# EAGLE design ow_lcd_mirror3 (EAGLE 6.5.0)
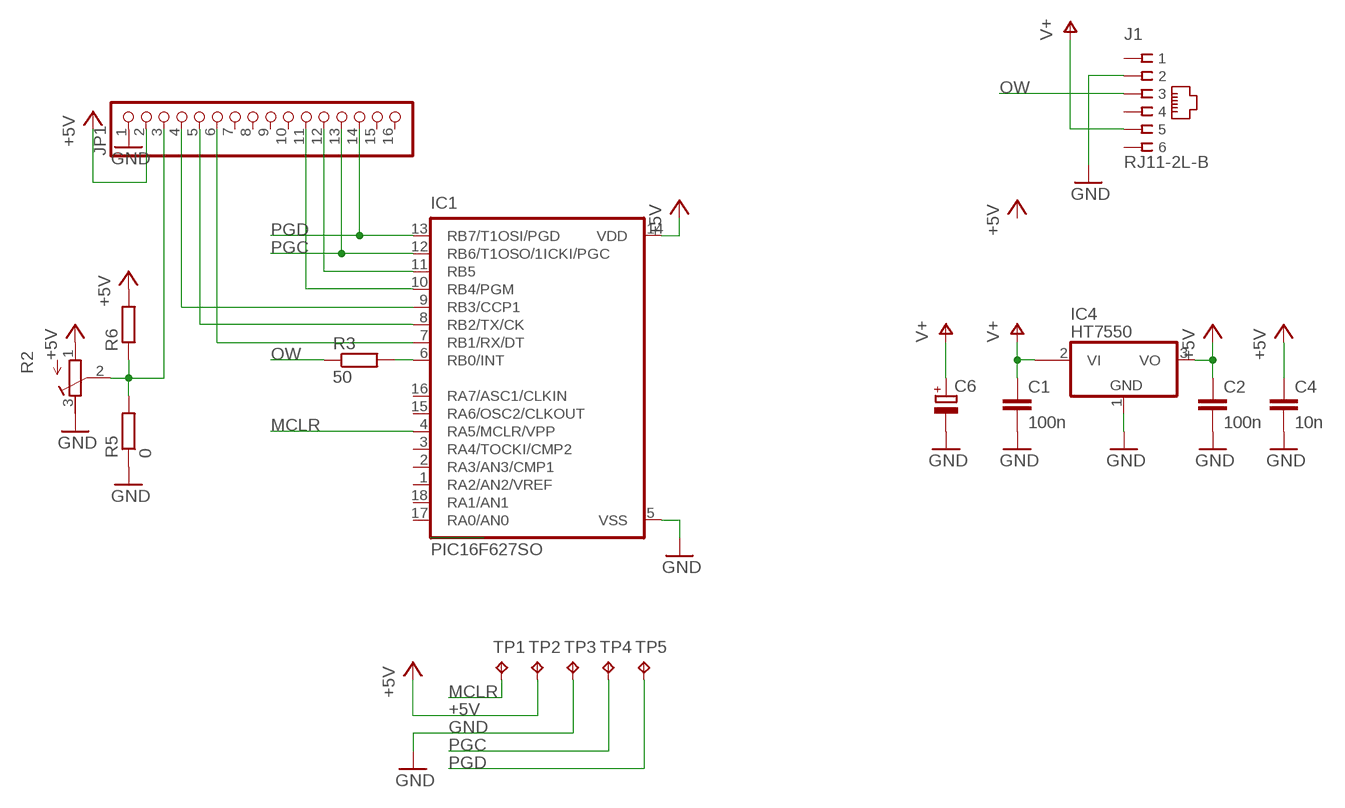
[diagram p0: schematic, sheet 1]

## Parts
C1  100n  C-EUC1206  [C1206]
C2  100n  C-EUC1206  [C1206]
C4  10n  C-EUC1206  [C1206]
C6  CPOL-EUC/6032-28R  [C/6032-28R]
IC1  PIC16F627SO  [SO-18W]
IC4  HT7550  MCP170312MB  [SOT89]
J1  RJ11-2L-B  [RJ11-NO_SHIELD]
JP1  PINHD-1X16  [1X16]
R2  R-TRIMM3339P  [RTRIM3339P]
R3  50  R-EU_M1206  [M1206]
R5  0  R-EU_R0805  [R0805]
R6  R-EU_R0805  [R0805]
TP1  TPB1,27  [B1,27]
TP2  TPB1,27  [B1,27]
TP3  TPB1,27  [B1,27]
TP4  TPB1,27  [B1,27]
TP5  TPB1,27  [B1,27]

## Nets
+5V: C2.1 C4.1 IC1.14(VDD) IC4.3(VO) JP1.2 R2.1(E) R6.2 TP2.TP
GND: C1.2 C2.2 C4.2 C6.- IC1.5(VSS) IC4.1(GND) J1.2 JP1.1 R2.3(A) R5.1 TP3.TP
MCLR: IC1.4(RA5/MCLR/VPP) TP1.TP
N$2: IC1.8(RB2/TX/CK) JP1.5
N$3: IC1.11(RB5) JP1.12
N$4: IC1.10(RB4/PGM) JP1.11
N$5: IC1.9(RB3/CCP1) JP1.4
N$6: IC1.7(RB1/RX/DT) JP1.6
N$8: JP1.3 R2.2(S) R5.2 R6.1
N$9: IC1.6(RB0/INT) R3.2
OW: J1.3 R3.1
PGC: IC1.12(RB6/T1OSO/1ICKI/PGC) JP1.13 TP4.TP
PGD: IC1.13(RB7/T1OSI/PGD) JP1.14 TP5.TP
V+: C1.1 C6.+ IC4.2@1(VI1) J1.5
Unconnected: IC1.1(RA2/AN2/VREF) IC1.2(RA3/AN3/CMP1) IC1.3(RA4/TOCKI/CMP2) IC1.15(RA6/OSC2/CLKOUT) IC1.16(RA7/ASC1/CLKIN) IC1.17(RA0/AN0) IC1.18(RA1/AN1) IC4.2(VI) J1.1 J1.4 J1.6 JP1.7 JP1.8 JP1.9 JP1.10 JP1.15 JP1.16

## Library data of the parts
C1 C2 C4 = rcl:C-EU: CAPACITOR, European symbol
C6 = rcl:CPOL-EU: POLARIZED CAPACITOR, European symbol
IC1 = microchip:PIC16*F62: FLASH-Based 8-Bit CMOS Microcontroller Source: http://ww1.microchip.com/downloads/en/DeviceDoc/40300C.pdf; MF: MICROCHIP; MPN: PIC16F627-04/SO; OC_FARNELL: 1084265; OC_NEWARK: 69K7632
IC4 = linear:MCP1703*: 250 mA, 16V, Low Quiescent Current LDO Regulator Source: http://ww1.microchip.com/downloads/en/DeviceDoc/22049b.pdf
J1 = con-tycoelectronics:RJ11: CORCOM Modular RJ Jacks No Shield Source: www.tycoelectronics.com .. ENG_DS_1654001_1099_RJ_L_0507.pdf; MF: TYCO ELECTRONICS; MPN: RJ11-2L-B; OC_FARNELL: unknown; OC_NEWARK: 83F4463
JP1 = pinhead:PINHD-1X16: PIN HEADER
R2 = resistor:R-TRIMM: Trimm resistor
R3 = resistor:R-EU_: RESISTOR, European symbol
R5 R6 = rcl:R-EU_: RESISTOR, European symbol
TP1-TP5 = testpad:TP: Test pad

## Board
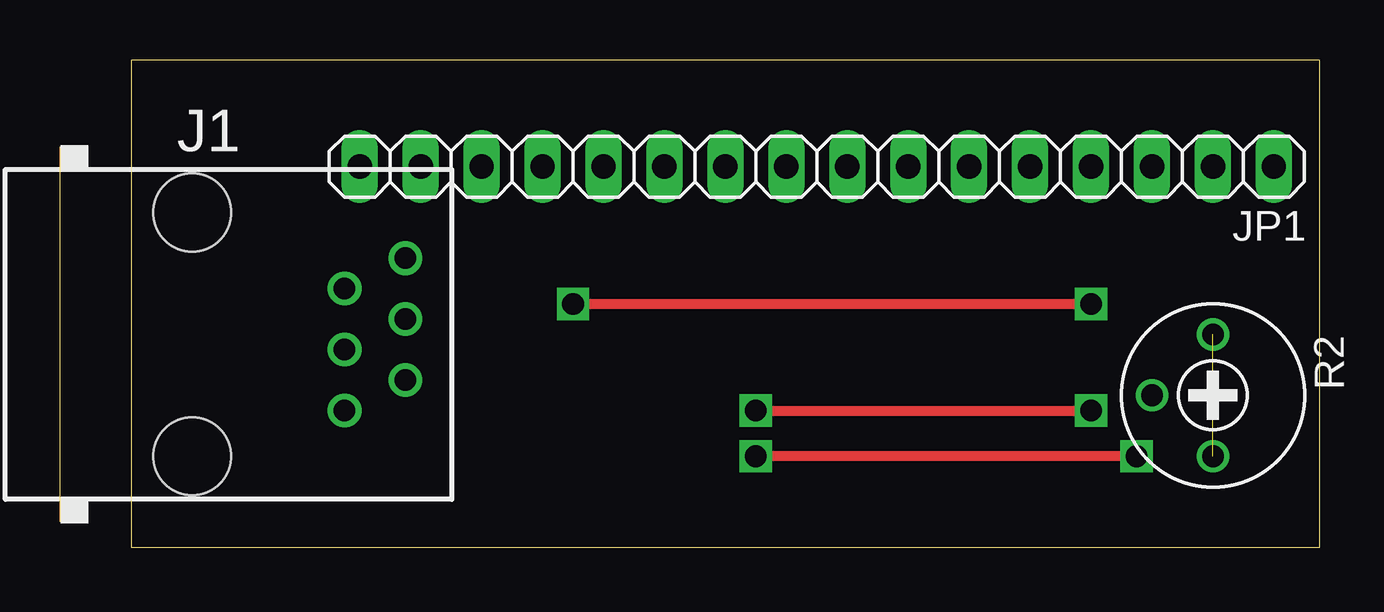
[diagram p1: board, top side]
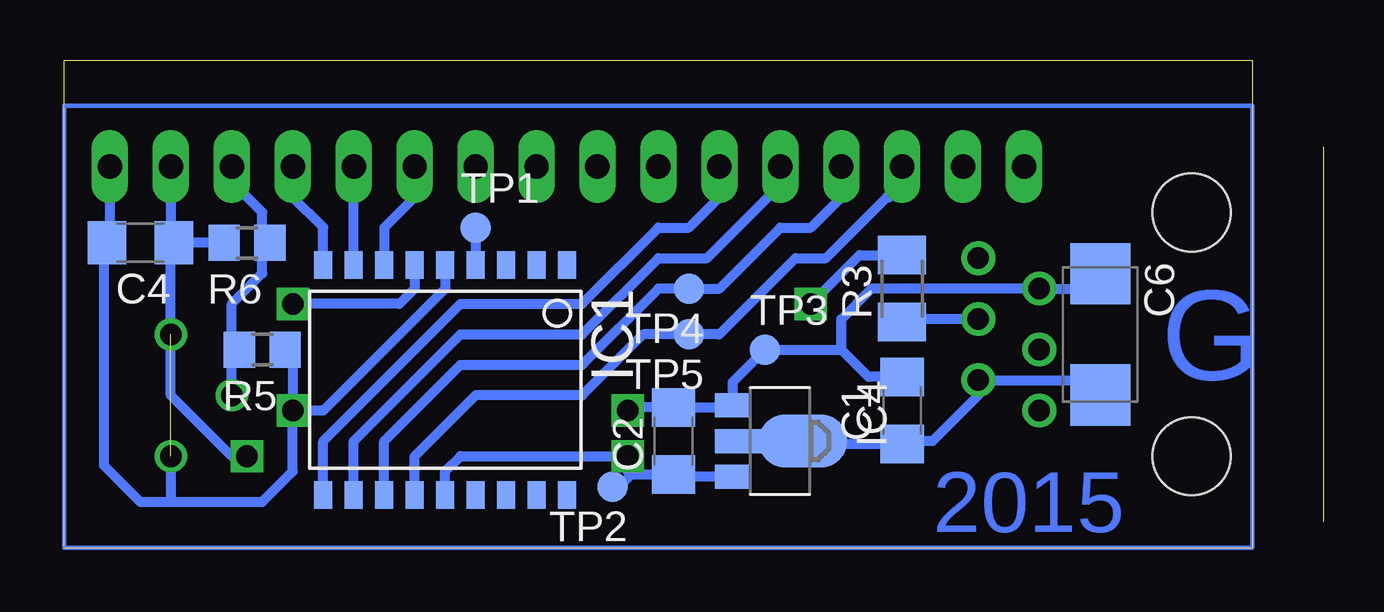
[diagram p2: board, bottom side, seen from below]

Size 52.51 x 20.33 mm. Coordinates in mm from the lower left corner, seen from the top.
Outline: 52.51,0 52.5,20.33 2.97,20.32 2.97,0.01
Outline: 52.5,0.01 2.97,0
Copper layers (1*16): Top 0.035mm / dielectric 1.5mm / Bottom 0.035mm
Design rules "default": minimum track width 10mil, minimum drill 24mil, track to track 8mil, track to pad 8mil, pad to pad 8mil, via to via 8mil, smd to smd 8mil, copper to edge 40mil, drill to drill 8mil, minimum pad ring 10mil, minimum via ring 8mil, stop-mask expansion 4mil, vias tented up to drill 0mil, thermal gap 10mil

### Footprints (pad centres in the part's own frame; a part is rotated, then mirrored left to right if it is on the bottom)
C1206 = smd 1.6 x 1.8: 1 -1.4,0; 2 1.4,0
C/6032-28R = smd 2.55 x 2.5: + 2.525,0; - -2.525,0
SO-18W = smd 0.762 x 1.143: 1 -5.08,-4.788; 2 -3.81,-4.788; 3 -2.54,-4.788; 4 -1.27,-4.788; 5 0,-4.788; 6 1.27,-4.788; 7 2.54,-4.788; 8 3.81,-4.788; 9 5.08,-4.788; 10 5.08,4.788; 11 3.81,4.788; 12 2.54,4.788; 13 1.27,4.788; 14 0,4.788; 15 -1.27,4.788; 16 -2.54,4.788; 17 -3.81,4.788; 18 -5.08,4.788
SOT89 = smd 1 x 1.5: 1 -1.499,-1.981; 3 1.499,-1.981 | smd 1 x 2: 2 0,-1.727 | smd 2.2 x 3.7: 2@1 0,0.94
RJ11-NO_SHIELD = drill 0.9 pad 1.4: 1 -3.175,8.89; 2 -1.905,6.35; 3 -0.635,8.89; 4 0.635,6.35; 5 1.905,8.89; 6 3.175,6.35 | hole 3.251: -5.08,0; 5.08,0
1X16 = drill 1.016 long: 1 -19.05,0; 2 -16.51,0; 3 -13.97,0; 4 -11.43,0; 5 -8.89,0; 6 -6.35,0; 7 -3.81,0; 8 -1.27,0; 9 1.27,0; 10 3.81,0; 11 6.35,0; 12 8.89,0; 13 11.43,0; 14 13.97,0; 15 16.51,0; 16 19.05,0
RTRIM3339P = drill 0.61: 1 -2.54,0; 2 0,-2.54; 3 2.54,0
M1206 = smd 1.6 x 2: 1 -1.4,0; 2 1.4,0
R0805 = smd 1.3 x 1.5: 1 -0.95,0; 2 0.95,0
B1,27 = smd 1.27 x 1.27: TP 0,0

### Placement (x,y rotation side)
C1  17.57,5.72 90 bottom
C2  27.1,4.46 90 bottom
C4  49.32,12.71 180 bottom
C6  9.32,8.9 270 bottom
IC1  36.62,7 180 bottom
IC4  22.65,4.46 270 bottom
J1  5.51,8.9 270 top
JP1  31.54,15.89 180 top
R2  48.05,6.36 270 top
R3  17.57,10.8 90 bottom
R5  44.24,8.27 180 bottom
R6  44.88,12.71 180 bottom
TP1  35.35,13.34 0 bottom
TP2  29.64,2.55 180 bottom
TP3  23.29,8.27 0 bottom
TP4  26.46,10.8 180 bottom
TP5  26.46,8.9 180 bottom

### Tracks (layer width: path | path; a pad name or v marks a point on that pad's centre or on a via)
+5V  (via drill 0.7, 0.9)
  Top 0.406: v44.88,3.82 v29,3.82
  Bottom 0.406: IC1.14 36.62,3.19 35.99,3.82 v29,3.82 29,3.19 28.88,3.05 | IC4.3 27,2.96 C2.1 28.88,3.05 | TP2.TP 29.38,2.55 28.88,3.05 | C4.1 48.3,12.71 | JP1.2 48.05,12.84 C4.1 | R6.2 C4.1 | C4.1 47.92,12.07 48.05,12.07 R2.1 48.05,6.36 45.52,3.82 v44.88,3.82
GND  (via drill 0.7, 0.9)
  Top 0.406: v29,5.72 v42.98,5.72
  Bottom 0.406: C6.- 9.94,10.8 J1.2 18.84,10.8 20.11,9.54 20.11,8.27 | IC1.5 36.62,10.8 41.7,5.72 v42.98,5.72 | v42.98,5.72 42.98,3.19 44.24,1.92 48.05,1.92 | v29,5.72 29.13,5.86 C2.2 24.73,5.86 IC4.1 24.64,6.92 TP3.TP 20.11,8.27 | 48.05,1.92 49.32,1.92 50.84,3.44 50.84,12.71 C4.2 50.59,12.84 JP1.1 | C1.2 18.97,7.12 20.11,8.27 | R5.1 42.98,8.27 v42.98,5.72 | R2.3 48.05,1.92
MCLR
  Bottom 0.406: TP1.TP IC1.4
N$1
  Bottom 0.178: 2.97,18.43 52.5,18.43 52.5,0.01 2.97,0.01 2.97,18.43
N$2
  Bottom 0.406: IC1.8 JP1.5
N$3
  Bottom 0.406: IC1.11 40.44,4.46 35.99,8.9 30.91,8.9 27.73,12.07 25.7,12.07 22.65,15.12 JP1.12
N$4
  Bottom 0.406: IC1.10 41.7,4.46 35.99,10.17 30.91,10.17 27.73,13.34 26.46,13.34 25.2,14.61 JP1.11
N$5
  Bottom 0.406: IC1.9 41.7,13.36 41.71,13.36 42.98,14.61 JP1.4
N$6
  Bottom 0.406: IC1.7 39.16,13.34 37.89,14.61 JP1.6
N$7  (via drill 0.9)  (1 unrouted)
  other vias: 48.05,3.82 48.05,8.9
N$8
  Bottom 0.178: R6.1 43.93,12.39 44.24,12.07
  Bottom 0.406: 45.77,6.61 R2.2 45.52,8.27 | 45.52,8.27 45.52,10.17 44.24,11.44 44.24,12.07 44.24,13.98 45.52,15.25 JP1.3 | R5.2 45.52,8.27
N$9  (via drill 0.7, 0.9)
  Top 0.406: v21.38,10.17 v42.98,10.17
  Bottom 0.406: IC1.6 37.89,10.8 38.53,10.17 v42.98,10.17 | v21.38,10.17 19.35,12.2 R3.2
N$10  (via drill 0.9)
  other vias: 45.52,6.36
N$11  (via drill 0.9)
  other vias: 42.98,5.72
N$12  (via drill 0.9)
  other vias: 42.98,10.17
OW
  Bottom 0.406: J1.3 17.45,9.54 R3.1
PGC
  Bottom 0.406: IC1.12 39.16,4.46 35.99,7.63 30.91,7.63 27.73,10.8 TP4.TP 25.2,10.8 22.65,13.34 21.38,13.34 20.11,14.61 JP1.13
PGD
  Bottom 0.406: IC1.13 37.89,3.82 35.35,6.36 30.91,6.36 28.37,8.9 TP5.TP 25.2,8.9 22.02,12.07 20.75,12.07 18.21,14.61 18.09,14.61 17.57,15.12 JP1.14
V+
  Bottom 0.406: IC4.2@1 21.38,4.46 21.25,4.33 C1.1 17.45,4.46 16.3,4.46 14.4,6.36 J1.5 9.65,7 9.32,6.67 C6.+
(copper drawn outside any net)
  shapes: Bottom circle x2

### Text on the board
Bottom: G | 2015